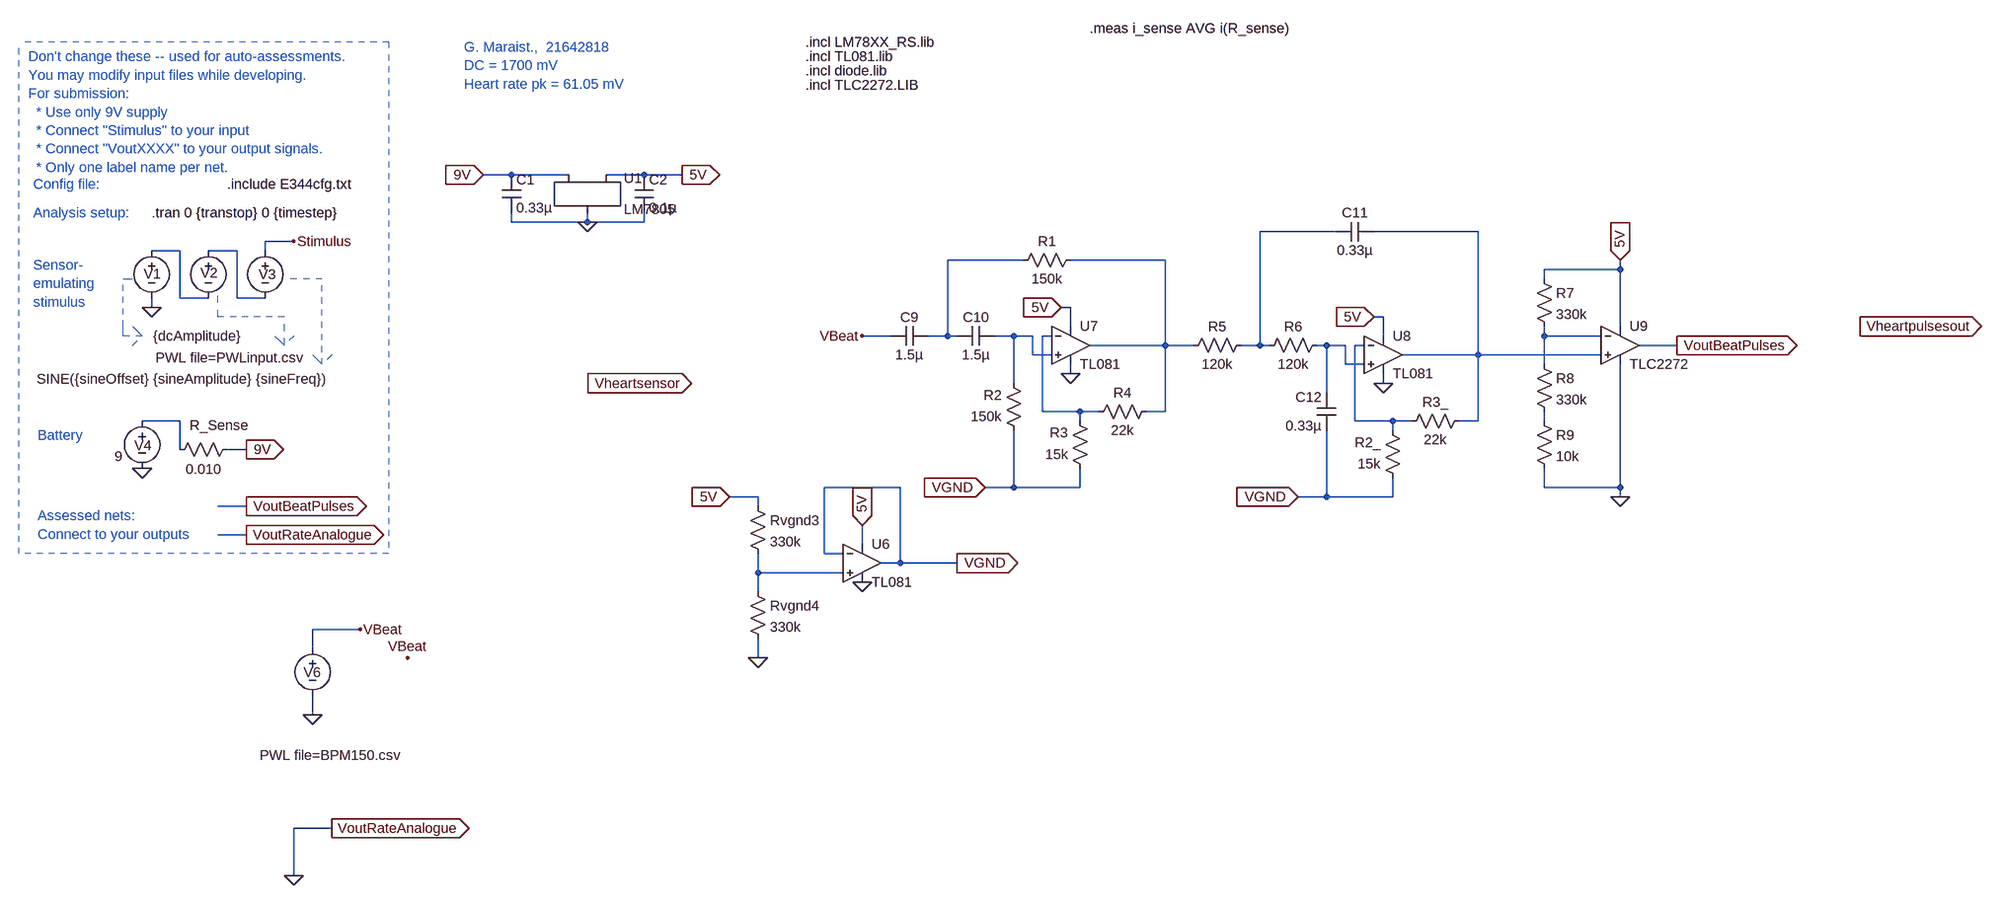
[diagram p0: schematic 21642818_Marais.asc]
21642818_Marais.asc, the LTspice schematic file:
Version 4
SHEET 1 2080 680
WIRE -1472 -1184 -1520 -1184
WIRE -1376 -1184 -1472 -1184
WIRE -1248 -1184 -1312 -1184
WIRE -1184 -1184 -1248 -1184
WIRE -1472 -1104 -1472 -1120
WIRE -1344 -1104 -1344 -1120
WIRE -1344 -1104 -1472 -1104
WIRE -1248 -1104 -1248 -1120
WIRE -1248 -1104 -1344 -1104
WIRE -80 -1088 -208 -1088
WIRE 160 -1088 -16 -1088
WIRE -1840 -1072 -1888 -1072
WIRE -2032 -1056 -2080 -1056
WIRE -1936 -1056 -1984 -1056
WIRE -1888 -1056 -1888 -1072
WIRE -608 -1040 -736 -1040
WIRE -368 -1040 -528 -1040
WIRE 400 -1024 400 -1040
WIRE 400 -1024 272 -1024
WIRE 272 -1008 272 -1024
WIRE -2032 -976 -2032 -1056
WIRE -1984 -976 -2032 -976
WIRE -1936 -976 -1936 -1056
WIRE -1888 -976 -1936 -976
WIRE -2080 -960 -2080 -976
WIRE -528 -960 -544 -960
WIRE 0 -944 -16 -944
WIRE -528 -928 -528 -960
WIRE 400 -928 400 -1024
WIRE -832 -912 -880 -912
WIRE -736 -912 -736 -1040
WIRE -736 -912 -768 -912
WIRE -720 -912 -736 -912
WIRE -624 -912 -656 -912
WIRE -592 -912 -624 -912
WIRE -560 -912 -576 -912
WIRE 0 -912 0 -944
WIRE 272 -912 272 -928
WIRE 368 -912 272 -912
WIRE -368 -896 -368 -1040
WIRE -368 -896 -496 -896
WIRE -320 -896 -368 -896
WIRE -208 -896 -208 -1088
WIRE -208 -896 -240 -896
WIRE -192 -896 -208 -896
WIRE -96 -896 -112 -896
WIRE -64 -896 -96 -896
WIRE -32 -896 -48 -896
WIRE 496 -896 432 -896
WIRE -592 -880 -592 -912
WIRE -560 -880 -592 -880
WIRE 160 -880 160 -1088
WIRE 160 -880 32 -880
WIRE 368 -880 160 -880
WIRE -64 -864 -64 -896
WIRE -32 -864 -64 -864
WIRE 272 -864 272 -912
WIRE -528 -848 -528 -864
WIRE -624 -832 -624 -912
WIRE 0 -832 0 -848
WIRE -96 -816 -96 -896
WIRE -576 -784 -576 -912
WIRE -512 -784 -576 -784
WIRE -480 -784 -512 -784
WIRE -368 -784 -368 -896
WIRE -368 -784 -400 -784
WIRE -2032 -768 -2096 -768
WIRE -512 -768 -512 -784
WIRE -48 -768 -48 -896
WIRE 16 -768 -48 -768
WIRE 48 -768 16 -768
WIRE 160 -768 160 -880
WIRE 160 -768 128 -768
WIRE 272 -768 272 -784
WIRE 16 -752 16 -768
WIRE -2032 -720 -2032 -768
WIRE -1920 -720 -1952 -720
WIRE -816 -656 -944 -656
WIRE -624 -656 -624 -752
WIRE -624 -656 -672 -656
WIRE -512 -656 -512 -688
WIRE -512 -656 -624 -656
WIRE 272 -656 272 -688
WIRE 400 -656 400 -864
WIRE 400 -656 272 -656
WIRE -1056 -640 -1104 -640
WIRE -96 -640 -96 -752
WIRE -96 -640 -144 -640
WIRE 16 -640 16 -672
WIRE 16 -640 -96 -640
WIRE 400 -640 400 -656
WIRE -1920 -624 -1968 -624
WIRE -1056 -624 -1056 -640
WIRE -1920 -576 -1968 -576
WIRE -880 -560 -880 -592
WIRE -944 -544 -944 -656
WIRE -912 -544 -944 -544
WIRE -816 -528 -816 -656
WIRE -816 -528 -848 -528
WIRE -720 -528 -816 -528
WIRE -1056 -512 -1056 -544
WIRE -912 -512 -1056 -512
WIRE -1056 -480 -1056 -512
WIRE -1728 -416 -1808 -416
WIRE -1808 -384 -1808 -416
WIRE -1056 -368 -1056 -400
WIRE -1808 -272 -1808 -304
WIRE -1776 -80 -1840 -80
WIRE -1840 0 -1840 -80
FLAG -2080 -960 0
FLAG -1840 -1072 Stimulus
FLAG -1920 -720 9V
IOPIN -1920 -720 Out
FLAG -2096 -688 0
FLAG -1520 -1184 9V
IOPIN -1520 -1184 In
FLAG -1920 -624 VoutBeatPulses
IOPIN -1920 -624 Out
FLAG -1920 -576 VoutRateAnalogue
IOPIN -1920 -576 Out
FLAG -1344 -1104 0
FLAG -1184 -1184 5V
IOPIN -1184 -1184 Out
FLAG -1808 -272 0
FLAG -1728 -416 VBeat
FLAG -1648 -368 VBeat
FLAG 496 -896 VoutBeatPulses
IOPIN 496 -896 Out
FLAG -1840 0 0
FLAG -1776 -80 VoutRateAnalogue
IOPIN -1776 -80 Out
FLAG -880 -912 VBeat
FLAG -1168 -832 Vheartsensor
IOPIN -1168 -832 In
FLAG 880 -928 Vheartpulsesout
IOPIN 880 -928 Out
FLAG -720 -528 VGND
IOPIN -720 -528 Out
FLAG -1056 -368 0
FLAG -1104 -640 5V
IOPIN -1104 -640 In
FLAG -880 -496 0
FLAG -880 -592 5V
IOPIN -880 -592 In
FLAG -528 -848 0
FLAG -544 -960 5V
IOPIN -544 -960 In
FLAG -672 -656 VGND
IOPIN -672 -656 In
FLAG 0 -832 0
FLAG -16 -944 5V
IOPIN -16 -944 In
FLAG -144 -640 VGND
IOPIN -144 -640 In
FLAG 400 -1040 5V
IOPIN 400 -1040 In
FLAG 400 -640 0
SYMBOL voltage -1984 -1072 R0
WINDOW 123 0 0 Left 0
WINDOW 39 0 0 Left 0
WINDOW 3 -89 197 Left 2
WINDOW 0 -13 54 Left 2
SYMATTR Value PWL file=PWLinput.csv
SYMATTR InstName V2
SYMBOL voltage -1888 -1072 R0
WINDOW 123 24 44 Left 2
WINDOW 39 0 0 Left 0
WINDOW 3 -386 233 Left 2
WINDOW 0 -11 56 Left 2
SYMATTR Value SINE({sineOffset} {sineAmplitude} {sineFreq})
SYMATTR InstName V3
SYMBOL voltage -2080 -1072 R0
WINDOW 123 0 0 Left 0
WINDOW 39 0 0 Left 0
WINDOW 3 3 160 Left 2
WINDOW 0 -13 55 Left 2
SYMATTR Value {dcAmplitude}
SYMATTR InstName V1
SYMBOL voltage -2096 -784 R0
WINDOW 123 24 44 Left 2
WINDOW 39 0 0 Left 0
WINDOW 3 -46 76 Left 2
WINDOW 0 -13 57 Left 2
SYMATTR Value 9
SYMATTR InstName V4
SYMBOL res -1936 -736 R90
WINDOW 0 -9 30 VBottom 2
WINDOW 3 34 56 VTop 2
SYMATTR InstName R_Sense
SYMATTR Value 0.010
SYMBOL LM7805 -1344 -1168 R0
SYMATTR InstName U1
SYMBOL cap -1488 -1184 R0
SYMATTR InstName C1
SYMATTR Value 0.33µ
SYMBOL cap -1264 -1184 R0
SYMATTR InstName C2
SYMATTR Value 0.1µ
SYMBOL voltage -1808 -400 R0
WINDOW 123 0 0 Left 0
WINDOW 39 0 0 Left 0
WINDOW 3 -89 197 Left 2
WINDOW 0 -15 57 Left 2
SYMATTR Value PWL file=BPM150.csv
SYMATTR InstName V6
SYMBOL res -1072 -640 R0
SYMATTR InstName Rvgnd3
SYMATTR Value 330k
SYMBOL res -1072 -496 R0
SYMATTR InstName Rvgnd4
SYMATTR Value 330k
SYMBOL Opamps\\opamp2 -880 -592 R0
SYMATTR InstName U6
SYMATTR Value TL081
SYMBOL cap -768 -928 R90
WINDOW 0 0 32 VBottom 2
WINDOW 3 32 32 VTop 2
SYMATTR InstName C9
SYMATTR Value 1.5µ
SYMBOL cap -656 -928 R90
WINDOW 0 0 32 VBottom 2
WINDOW 3 32 32 VTop 2
SYMATTR InstName C10
SYMATTR Value 1.5µ
SYMBOL res -512 -1056 R90
WINDOW 0 0 56 VBottom 2
WINDOW 3 32 56 VTop 2
SYMATTR InstName R1
SYMATTR Value 150k
SYMBOL res -608 -736 R180
WINDOW 0 36 76 Left 2
WINDOW 3 36 40 Left 2
SYMATTR InstName R2
SYMATTR Value 150k
SYMBOL res -496 -672 R180
WINDOW 0 36 76 Left 2
WINDOW 3 36 40 Left 2
SYMATTR InstName R3
SYMATTR Value 15k
SYMBOL res -384 -800 R90
WINDOW 0 0 56 VBottom 2
WINDOW 3 32 56 VTop 2
SYMATTR InstName R4
SYMATTR Value 22k
SYMBOL Opamps\\opamp2 -528 -960 R0
SYMATTR InstName U7
SYMATTR Value TL081
SYMBOL res 32 -656 R180
WINDOW 0 36 76 Left 2
WINDOW 3 36 40 Left 2
SYMATTR InstName R2_
SYMATTR Value 15k
SYMBOL res 144 -784 R90
WINDOW 0 0 56 VBottom 2
WINDOW 3 32 56 VTop 2
SYMATTR InstName R3_
SYMATTR Value 22k
SYMBOL Opamps\\opamp2 0 -944 R0
SYMATTR InstName U8
SYMATTR Value TL081
SYMBOL res -224 -912 R90
WINDOW 0 0 56 VBottom 2
WINDOW 3 32 56 VTop 2
SYMATTR InstName R5
SYMATTR Value 120k
SYMBOL res -96 -912 R90
WINDOW 0 0 56 VBottom 2
WINDOW 3 32 56 VTop 2
SYMATTR InstName R6
SYMATTR Value 120k
SYMBOL cap -16 -1104 R90
WINDOW 0 0 32 VBottom 2
WINDOW 3 32 32 VTop 2
SYMATTR InstName C11
SYMATTR Value 0.33µ
SYMBOL cap -80 -752 R180
WINDOW 0 24 56 Left 2
WINDOW 3 24 8 Left 2
SYMATTR InstName C12
SYMATTR Value 0.33µ
SYMBOL Opamps\\opamp2 400 -960 R0
SYMATTR InstName U9
SYMATTR Value TLC2272
SYMBOL res 256 -1024 R0
SYMATTR InstName R7
SYMATTR Value 330k
SYMBOL res 256 -880 R0
SYMATTR InstName R8
SYMATTR Value 330k
SYMBOL res 256 -784 R0
SYMATTR InstName R9
SYMATTR Value 10k
TEXT -2080 -1120 Left 2 !.tran 0 {transtop} 0 {timestep}
TEXT -1952 -1168 Left 2 !.include E344cfg.txt
TEXT -2288 -1384 Left 2 ;Don't change these -- used for auto-assessments.\nYou may modify input files while developing.\nFor submission: \n  * Use only 9V supply \n  * Connect "Stimulus" to your input\n  * Connect "VoutXXXX" to your output signals.\n  * Only one label name per net.
TEXT -2280 -1168 Left 2 ;Config file:
TEXT -2280 -1120 Left 2 ;Analysis setup:
TEXT -2272 -744 Left 2 ;Battery
TEXT -2280 -1032 Left 2 ;Sensor-\nemulating \nstimulus
TEXT -2272 -608 Left 2 ;Assessed nets:\nConnect to your outputs
TEXT -1552 -1400 Left 2 ;G. Maraist.,  21642818\nDC = 1700 mV\nHeart rate pk = 61.05 mV
TEXT -976 -1408 Left 2 !.incl LM78XX_RS.lib
TEXT -976 -1384 Left 2 !.incl TL081.lib
TEXT -976 -1360 Left 2 !.incl diode.lib
TEXT -976 -1336 Left 2 !.incl TLC2272.LIB
TEXT -496 -1432 Left 2 !.meas i_sense AVG i(R_sense)
LINE Normal -1792 -1008 -1856 -1008 2
LINE Normal -1792 -864 -1792 -1008 2
LINE Normal -1808 -880 -1792 -864 2
LINE Normal -1792 -864 -1808 -880 2
LINE Normal -1776 -880 -1792 -864 2
LINE Normal -2128 -1008 -2112 -1008 2
LINE Normal -2128 -928 -2128 -1008 2
LINE Normal -2128 -912 -2128 -928 2
LINE Normal -2096 -912 -2128 -912 2
LINE Normal -2112 -928 -2096 -912 2
LINE Normal -2096 -912 -2112 -928 2
LINE Normal -2112 -896 -2096 -912 2
LINE Normal -1968 -944 -1968 -992 2
LINE Normal -1856 -944 -1968 -944 2
LINE Normal -1856 -896 -1856 -944 2
LINE Normal -1872 -912 -1856 -896 2
LINE Normal -1856 -896 -1872 -912 2
LINE Normal -1840 -912 -1856 -896 2
LINE Normal -2304 -544 -2304 -1408 1
LINE Normal -1680 -1408 -1680 -544 1
LINE Normal -1680 -544 -2304 -544 1
LINE Normal -1680 -1408 -2304 -1408 1

The netlist it stands for:
* 21642818_Marais.asc
V2 N004 N003 PWL file=PWLinput.csv
V3 Stimulus N004 SINE({sineOffset} {sineAmplitude} {sineFreq})
V1 N003 0 {dcAmplitude}
V4 N012 0 9
R_Sense 9V N012 0.010
XU1 9V 0 5V LM7805
C1 9V 0 0.33µ
C2 5V 0 0.1µ
V6 VBeat 0 PWL file=BPM150.csv
Rvgnd3 5V N014 330k
Rvgnd4 N014 0 330k
XU6 N014 VGND 5V 0 VGND TL081  ; pins In+ In- V+ V- OUT
C9 N005 VBeat 1.5µ
C10 N007 N005 1.5µ
R1 N006 N005 150k
R2 VGND N007 150k
R3 VGND N008 15k
R4 N006 N008 22k
XU7 N007 N008 5V 0 N006 TL081  ; pins In+ In- V+ V- OUT
R2_ VGND N011 15k
R3_ N002 N011 22k
XU8 N010 N011 5V 0 N002 TL081  ; pins In+ In- V+ V- OUT
R5 N001 N006 120k
R6 N010 N001 120k
C11 N002 N001 0.33µ
C12 VGND N010 0.33µ
XU9 N002 N009 5V 0 VoutBeatPulses TLC2272  ; pins In+ In- V+ V- OUT
R7 5V N009 330k
R8 N009 N013 330k
R9 N013 0 10k
.tran 0 {transtop} 0 {timestep}
.include E344cfg.txt
* Don't change these -- used for auto-assessments.
* You may modify input files while developing.
* For submission:
*   * Use only 9V supply
*   * Connect "Stimulus" to your input
*   * Connect "VoutXXXX" to your output signals.
*   * Only one label name per net.
* Config file:
* Analysis setup:
* Battery
* Sensor-
* emulating
* stimulus
* Assessed nets:
* Connect to your outputs
* G. Maraist.,  21642818
* DC = 1700 mV
* Heart rate pk = 61.05 mV
.incl LM78XX_RS.lib
.incl TL081.lib
.incl diode.lib
.incl TLC2272.LIB
.meas i_sense AVG i(R_sense)
.backanno
.end